# EAGLE design lumy (EAGLE 6.1)
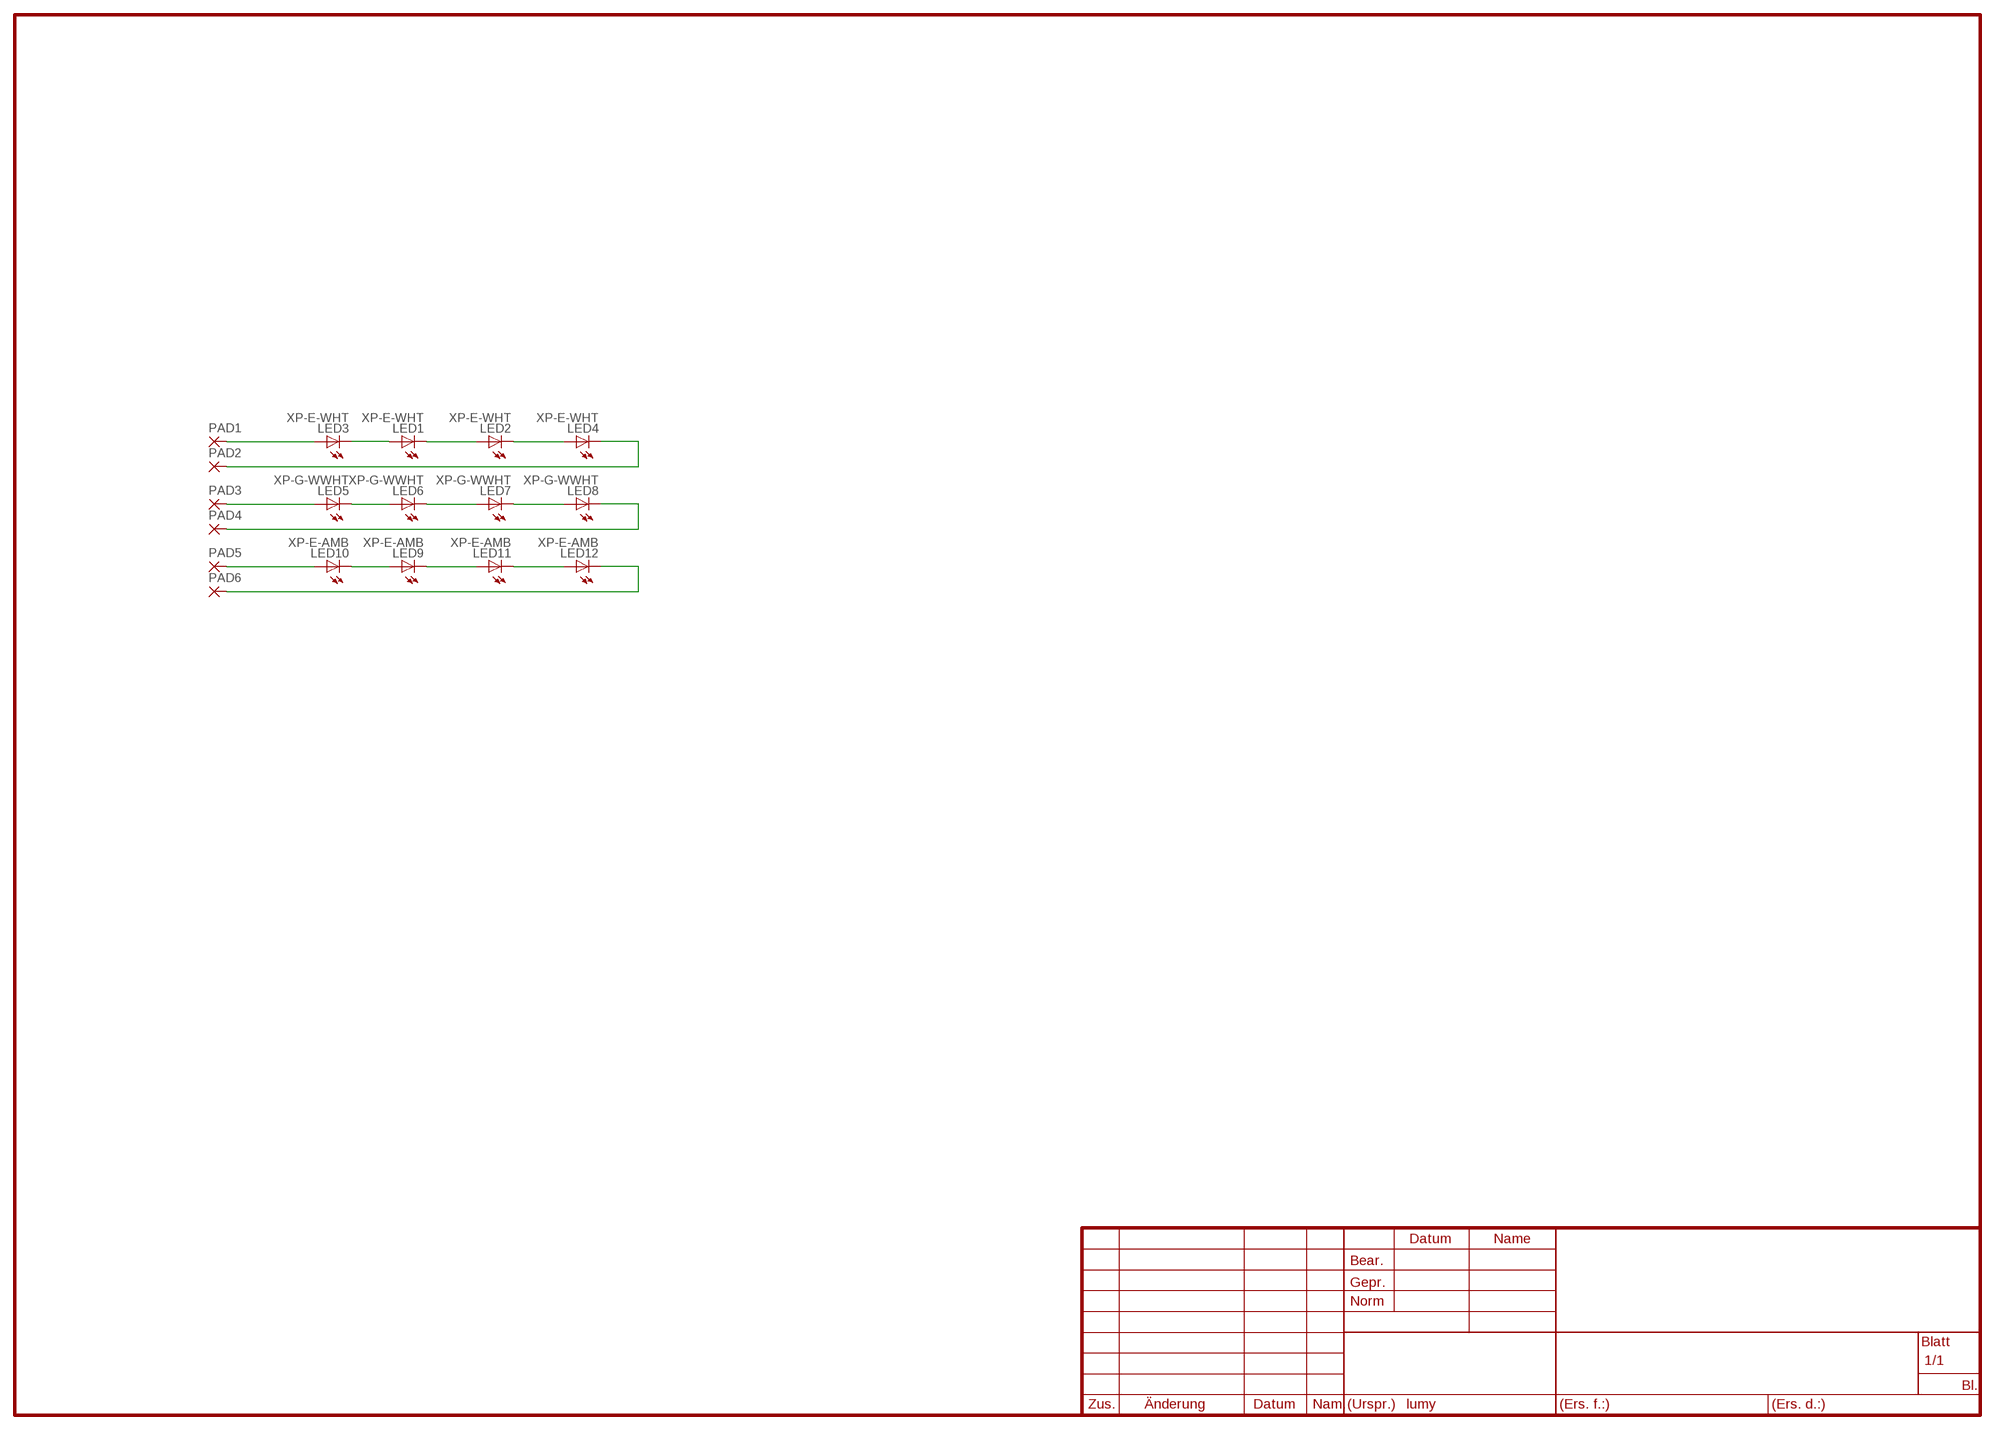
[diagram p0: schematic, sheet 1]

## Parts
LED1  XP-E-WHT  XPEWHT-01-0000-00BC2  [CREE_XLAMP]
LED2  XP-E-WHT  XPEWHT-01-0000-00BC2  [CREE_XLAMP]
LED3  XP-E-WHT  XPEWHT-01-0000-00BC2  [CREE_XLAMP]
LED4  XP-E-WHT  XPEWHT-01-0000-00BC2  [CREE_XLAMP]
LED5  XP-G-WWHT  XPEWHT-01-0000-00BC2  [CREE_XLAMP]
LED6  XP-G-WWHT  XPEWHT-01-0000-00BC2  [CREE_XLAMP]
LED7  XP-G-WWHT  XPEWHT-01-0000-00BC2  [CREE_XLAMP]
LED8  XP-G-WWHT  XPEWHT-01-0000-00BC2  [CREE_XLAMP]
LED9  XP-E-AMB  XPEWHT-01-0000-00BC2  [CREE_XLAMP]
LED10  XP-E-AMB  XPEWHT-01-0000-00BC2  [CREE_XLAMP]
LED11  XP-E-AMB  XPEWHT-01-0000-00BC2  [CREE_XLAMP]
LED12  XP-E-AMB  XPEWHT-01-0000-00BC2  [CREE_XLAMP]
PAD1  SMD2  [SMD1,27-2,54]
PAD2  SMD2  [SMD1,27-2,54]
PAD3  SMD2  [SMD1,27-2,54]
PAD4  SMD2  [SMD1,27-2,54]
PAD5  SMD2  [SMD1,27-2,54]
PAD6  SMD2  [SMD1,27-2,54]

## Nets
N$1: LED1.A LED1.A@1(A) LED3.C LED3.C@1(C)
N$2: LED1.C LED1.C@1(C) LED2.A LED2.A@1(A)
N$3: LED2.C LED2.C@1(C) LED4.A LED4.A@1(A)
N$4: LED7.C LED7.C@1(C) LED8.A LED8.A@1(A)
N$5: LED6.C LED6.C@1(C) LED7.A LED7.A@1(A)
N$6: LED5.C LED5.C@1(C) LED6.A LED6.A@1(A)
N$7: LED3.A LED3.A@1(A) PAD1.1(P)
N$8: LED9.A LED9.A@1(A) LED10.C LED10.C@1(C)
N$9: LED9.C LED9.C@1(C) LED11.A LED11.A@1(A)
N$10: LED11.C LED11.C@1(C) LED12.A LED12.A@1(A)
N$11: LED4.C LED4.C@1(C) PAD2.1(P)
N$12: LED5.A LED5.A@1(A) PAD3.1(P)
N$13: LED8.C LED8.C@1(C) PAD4.1(P)
N$14: LED10.A LED10.A@1(A) PAD5.1(P)
N$15: LED12.C LED12.C@1(C) PAD6.1(P)

## Library data of the parts
LED1-LED12 = led:XPEWHT-: Cree® XLamp® XP-E LEDs Source: www.cree.com/xlamp .. XLampXP-E.pdf
PAD1-PAD6 = wirepad:SMD2: SMD PAD

## Board
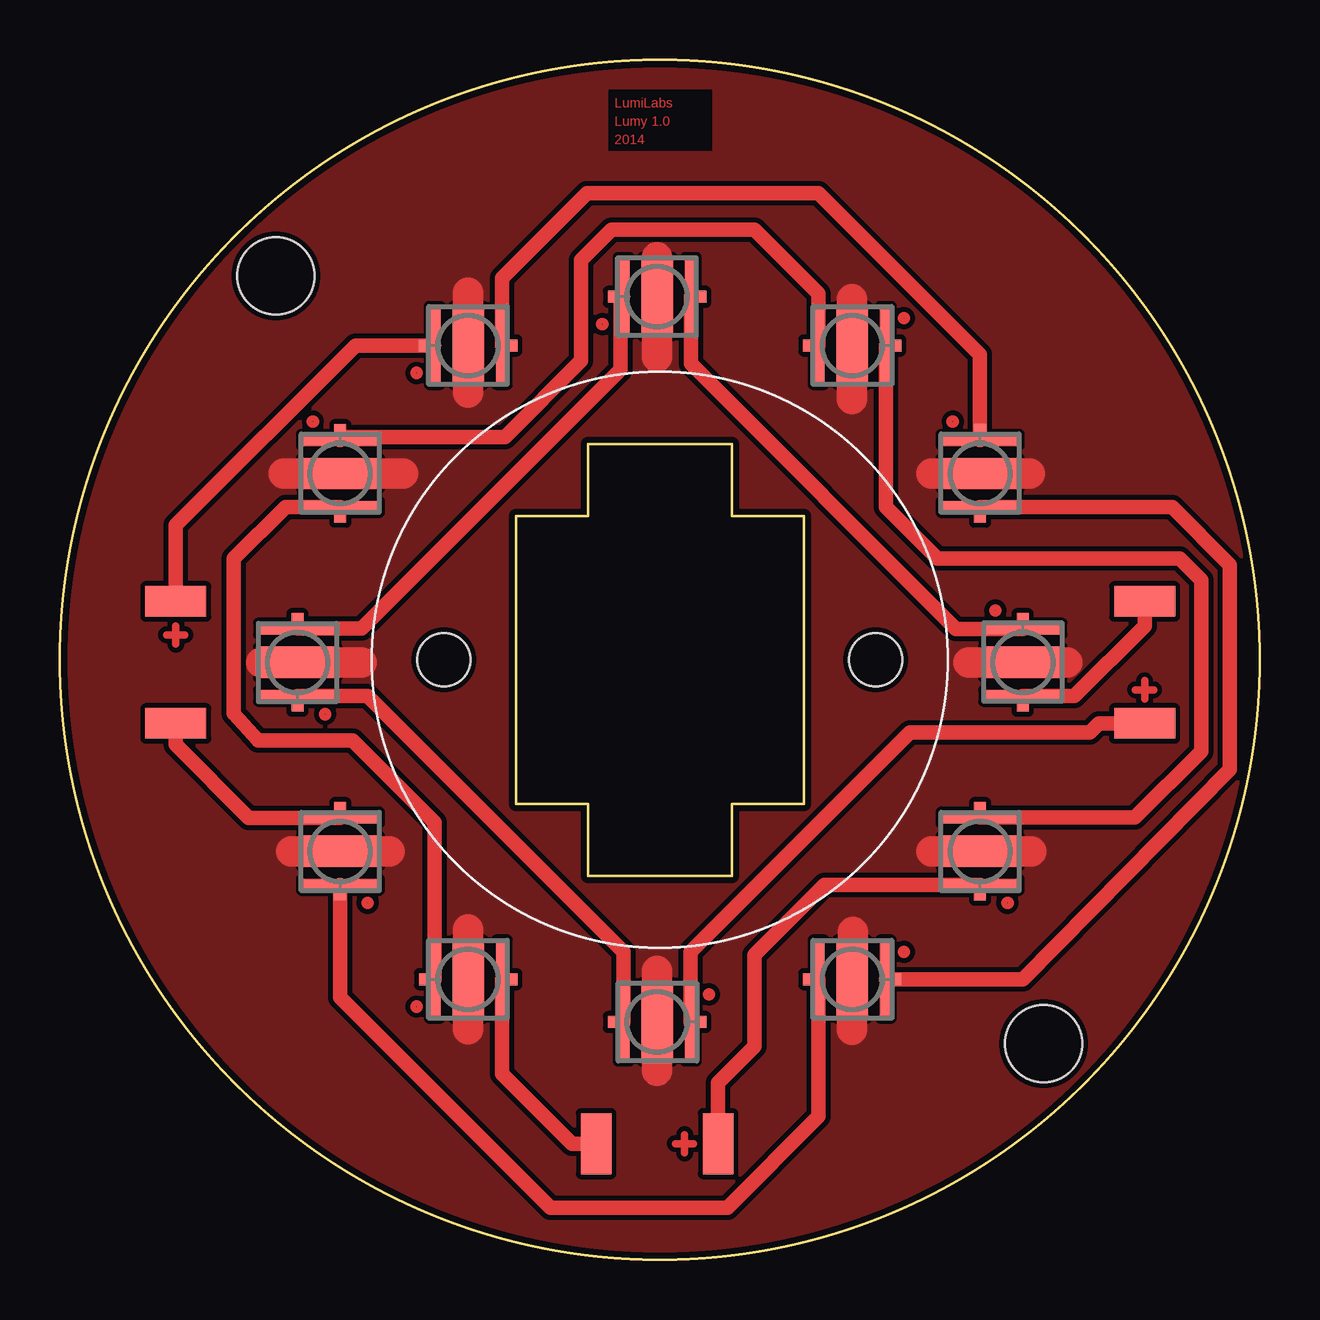
[diagram p1: board, top side]

Size 50 x 50 mm. Coordinates in mm from the lower left corner, seen from the top.
Outline: 19,31 19,19 22,19 22,16 28,16 28,19 31,19 31,31 28,31 28,34 22,34 22,31 19,31
Outline: circle at 25,25 radius 25
Copper layers (1*16): Top 0.035mm / dielectric 1.5mm / Bottom 0.035mm
Design rules: minimum track width 10mil, minimum drill 10mil, track to track 8mil, track to pad 8mil, pad to pad 8mil, via to via 8mil, smd to smd 8mil, copper to edge 10mil, drill to drill 8mil, minimum pad ring 10mil, minimum via ring 8mil, stop-mask expansion 4mil, vias tented up to drill 0mil, thermal gap 10mil
Holes 2.2 mm at 34,25 16,25
Holes 3.2 mm at 9,41 41,9
tRestrict: area 22.9,46.2 to 27.2,48.8

### Footprints (pad centres in the part's own frame; a part is rotated, then mirrored left to right if it is on the bottom)
CREE_XLAMP = smd 0.5 x 3.3: A -1.4,0; C 1.4,0 | smd 0.45 x 0.5: A@1 -1.825,0; C@1 1.825,0 | smd 1.3 x 3.3: X 0,0
SMD1,27-2,54 = smd 1.27 x 2.54: 1 0,0

### Placement (x,y rotation side)
LED1  9.91,24.89 90 top
LED2  24.89,40.13 0 top
LED3  24.89,9.91 180 top
LED4  40.13,24.89 270 top
LED5  17.02,38.1 0 top
LED6  38.35,32.77 270 top
LED7  33.02,11.68 180 top
LED8  11.68,17.02 90 top
LED9  33.02,38.1 180 top
LED10  38.35,17.02 90 top
LED11  11.68,32.77 270 top
LED12  17.02,11.68 0 top
PAD1  45.21,22.35 90 top
PAD2  45.21,27.43 90 top
PAD3  4.83,27.43 90 top
PAD4  4.83,22.35 90 top
PAD5  27.43,4.83 180 top
PAD6  22.35,4.83 0 top

### Tracks (layer width: path | path; a pad name or v marks a point on that pad's centre or on a via)
GND
  Top 1.27: 9.32,32.77 14.3,32.77 | 8.38,24.89 12.57,24.89 | 9.63,17.02 13.74,17.02 | 36.32,32.77 40.44,32.77 | 37.87,24.89 41.99,24.89 | 36.32,17.02 40.49,17.02 | 33.02,9.58 33.05,13.66 | 24.89,7.87 24.89,12.04 | 17.02,9.6 17.02,13.77 | 17.02,36.14 17.02,40.31 | 24.89,37.62 24.89,41.78 | 33.02,35.87 33.02,40.03
  pour Top: 0.25,25.15 arc-90 24.64,49.78 25.4,49.78 arc-90 49.78,25.4 49.78,24.64 arc-90 25.4,0.25 24.89,0.25 arc-90
N$1
  Top 0.406: LED1.A@1 LED1.A | LED3.C LED3.C@1
  Top 0.61: LED3.C 23.49,12.83 12.83,23.49 LED1.A
N$2
  Top 0.406: 23.37,40.01 23.24,40.01 23.24,40.13 LED2.A@1 LED2.A | LED1.C LED1.C@1
  Top 0.61: 23.37,40.01 23.37,37.08 12.58,26.29 LED1.C
N$3
  Top 0.406: LED2.C LED2.C@1 | LED4.A LED4.A@1
  Top 0.61: LED2.C 26.29,37.34 37.34,26.29 LED4.A
N$4
  Top 0.406: LED7.C LED7.C@1
  Top 0.61: LED7.C 31.62,5.97 27.81,2.16 20.45,2.16 11.68,10.92 LED8.A@1 LED8.A
N$5
  Top 0.406: LED6.C LED6.C@1
  Top 0.61: LED6.C 46.1,31.37 | 46.1,31.37 | LED7.A@1 40.13,11.68 48.77,20.42 48.77,28.96 46.36,31.37 46.1,31.37 | LED7.A@1 34.8,11.68 | LED7.A@1 LED7.A
N$6
  Top 0.406: LED5.C LED5.C@1
  Top 0.61: LED5.C 18.42,40.9 21.97,44.45 31.62,44.45 38.35,37.72 LED6.A@1 LED6.A
N$7
  Top 0.406: LED3.A LED3.A@1
  Top 0.61: PAD1.1 43.31,22.35 42.93,21.97 35.43,21.97 26.29,12.83 LED3.A
N$8
  Top 0.406: LED9.A LED9.A@1 | LED10.C LED10.C@1
  Top 0.61: LED10.C 44.81,18.42 47.57,21.18 47.57,28.32 46.68,29.21 36.58,29.21 34.42,31.37 LED9.A
N$9
  Top 0.406: 11.81,34.29 11.68,34.29 LED11.A@1 | 31.5,38.1 LED9.C@1
  Top 0.61: LED11.A 11.81,34.29 18.54,34.29 21.72,37.47 21.72,41.66 22.99,42.93 28.96,42.93 31.62,40.26 31.62,38.23 | 31.62,38.23 31.5,38.1 | 31.62,38.23 LED9.C
N$10
  Top 0.406: LED12.A LED12.A@1 | LED11.C LED11.C@1
  Top 0.61: LED12.A 15.62,18.22 12.19,21.64 8.26,21.64 7.24,22.76 7.24,29.21 9.4,31.37 LED11.C
N$11
  Top 0.406: LED4.C LED4.C@1
  Top 0.61: LED4.C 42.29,23.49 45.21,26.42 PAD2.1
N$12
  Top 0.406: LED5.A LED5.A@1
  Top 0.61: PAD3.1 4.83,30.61 12.32,38.1 LED5.A@1 15.52,38.1
N$13
  Top 0.406: LED8.C LED8.C@1
  Top 0.61: PAD4.1 4.83,21.46 7.87,18.41 LED8.C
N$14
  Top 0.406: LED10.A LED10.A@1
  Top 0.61: PAD5.1 27.43,7.37 28.96,8.89 28.96,12.7 31.87,15.62 LED10.A
N$15
  Top 0.406: LED12.C LED12.C@1
  Top 0.61: LED12.C 18.42,7.74 21.34,4.83 PAD6.1
N$19
  Top 0.305: 4.83,26.42 4.83,25.65
N$21
  Top 0.305: 4.45,26.04 5.21,26.04
N$22
  Top 0.305: 45.21,23.37 45.21,24.13
N$23
  Top 0.305: 44.83,23.75 45.59,23.75
N$24
  Top 0.305: 26.42,4.83 25.65,4.83
N$25
  Top 0.305: 26.04,5.21 26.04,4.45
(copper drawn outside any net)
  shapes: Top circle x12

### Text on the board
Top: LumiLabs | Lumy 1.0 | 2014